# EAGLE design WhatFrankShould'veDone (EAGLE 6.3)
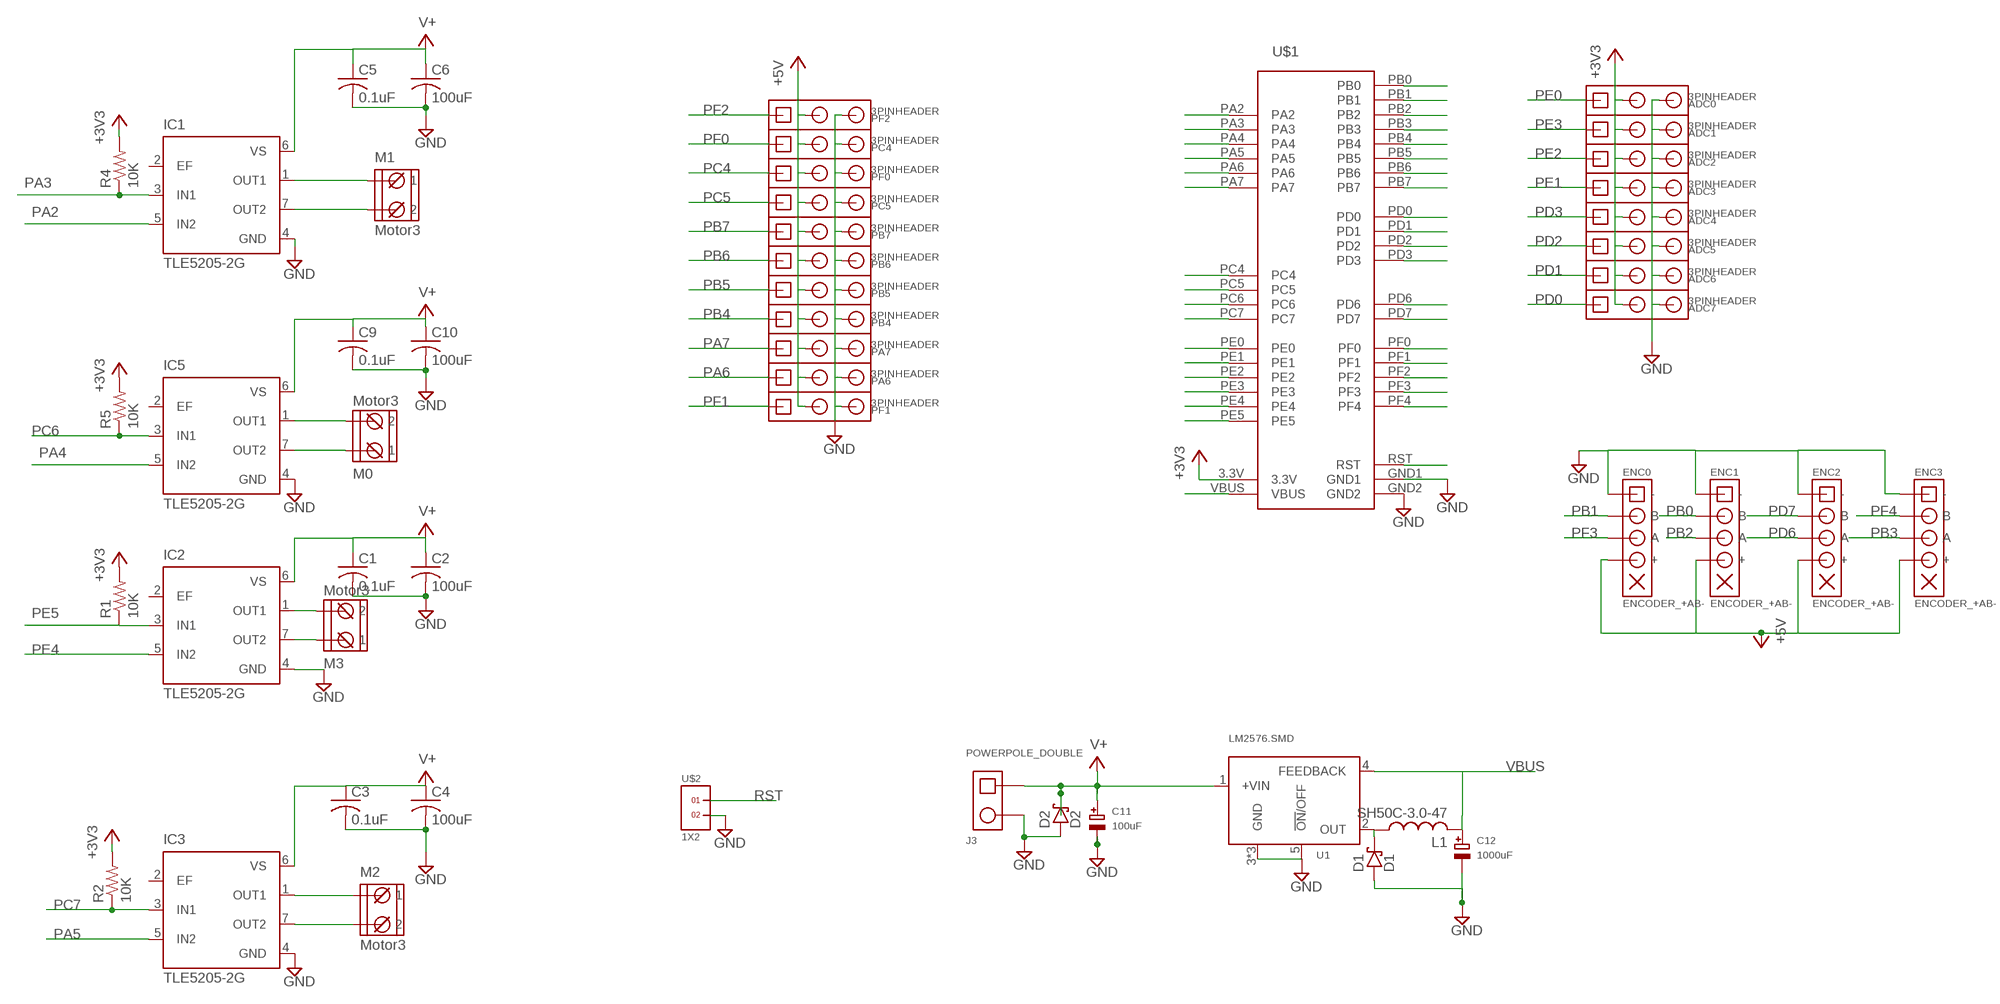
[diagram p0: schematic, sheet 1]

## Parts
ADC0  3PINHEADER  [3PINHEADER]
ADC1  3PINHEADER  [3PINHEADER]
ADC2  3PINHEADER  [3PINHEADER]
ADC3  3PINHEADER  [3PINHEADER]
ADC4  3PINHEADER  [3PINHEADER]
ADC5  3PINHEADER  [3PINHEADER]
ADC6  3PINHEADER  [3PINHEADER]
ADC7  3PINHEADER  [3PINHEADER]
C1  0.1uF  C-USC0603  [C0603]
C2  100uF  C-USC0603  [C0603]
C3  0.1uF  C-USC0603  [C0603]
C4  100uF  C-USC0603  [C0603]
C5  0.1uF  C-USC0603  [C0603]
C6  100uF  C-USC0603  [C0603]
C9  0.1uF  C-USC0603  [C0603]
C10  100uF  C-USC0603  [C0603]
C11  100uF  CAP_ELECTROLYTICPANASONIC_D  [PANASONIC_D]
C12  1000uF  CAP_ELECTROLYTICPANASONIC_D  [PANASONIC_D]
D1  D1  1N5820-D  [DIODE_17MM]
D2  D2  1N5820-D  [DIODE_17MM]
ENC0  ENCODER_+AB-  [0.1IN_HEADER_1X5]
ENC1  ENCODER_+AB-  [0.1IN_HEADER_1X5]
ENC2  ENCODER_+AB-  [0.1IN_HEADER_1X5]
ENC3  ENCODER_+AB-  [0.1IN_HEADER_1X5]
IC1  TLE5205-2G  [P-TO263-7-1]
IC2  TLE5205-2G  [P-TO263-7-1]
IC3  TLE5205-2G  [P-TO263-7-1]
IC5  TLE5205-2G  [P-TO263-7-1]
J3  POWERPOLE_DOUBLE  [POWERPOLE_DOUBLE]
L1  SH50C-3.0-47  [SH50-C2]
M0  Motor3  PHOENIXSCREWTERMINAL_2  [PHOENIXSCREWTERMINAL_2]
M1  Motor3  PHOENIXSCREWTERMINAL_2  [PHOENIXSCREWTERMINAL_2]
M2  Motor3  PHOENIXSCREWTERMINAL_2  [PHOENIXSCREWTERMINAL_2]
M3  Motor3  PHOENIXSCREWTERMINAL_2  [PHOENIXSCREWTERMINAL_2]
PA6  3PINHEADER  [3PINHEADER]
PA7  3PINHEADER  [3PINHEADER]
PB4  3PINHEADER  [3PINHEADER]
PB5  3PINHEADER  [3PINHEADER]
PB6  3PINHEADER  [3PINHEADER]
PB7  3PINHEADER  [3PINHEADER]
PC4  3PINHEADER  [3PINHEADER]
PC5  3PINHEADER  [3PINHEADER]
PF0  3PINHEADER  [3PINHEADER]
PF1  3PINHEADER  [3PINHEADER]
PF2  3PINHEADER  [3PINHEADER]
R1  10K  R-US_R0603  [R0603]
R2  10K  R-US_R0603  [R0603]
R4  10K  R-US_R0603  [R0603]
R5  10K  R-US_R0603  [R0603]
U1  LM2576.SMD  [KTT0005B]
U$1  STELLARIS-LAUNCHPADSTELLARIS-LAUNCHPAD-XL  [LAUNCHPAD-XL]
U$2  1X2  [1X2]

## Nets
+3V3: ADC0.2 ADC1.2 ADC2.2 ADC3.2 ADC4.2 ADC5.2 ADC6.2 ADC7.2 R1.2 R2.2 R4.2 R5.2 U$1.3.3V
+5V: ENC0.4(+) ENC1.4(+) ENC2.4(+) ENC3.4(+) PA6.2 PA7.2 PB4.2 PB5.2 PB6.2 PB7.2 PC4.2 PC5.2 PF0.2 PF1.2 PF2.2
-GND: ADC0.3 ADC1.3 ADC2.3 ADC3.3 ADC4.3 ADC5.3 ADC6.3 ADC7.3 C1.2 C2.2 C3.2 C4.2 C5.2 C6.2 C9.2 C10.2 C11.- C12.- D1.2(A) D2.2(A) ENC0.1(-) ENC1.1(-) ENC2.1(-) ENC3.1(-) IC1.4(GND) IC2.4(GND) IC3.4(GND) IC5.4(GND) J3.2 PA6.3 PA7.3 PB4.3 PB5.3 PB6.3 PB7.3 PC4.3 PC5.3 PF0.3 PF1.3 PF2.3 U1.3(GND) U1.5(!ON!/OFF) U1.GROUND(GND) U1.GROUND@1(GND) U$1.GND1 U$1.GND2 U$2.2 ; supply symbol labelled GND
N$2: IC2.1(OUT1) M3.2
N$4: IC2.7(OUT2) M3.1
N$6: IC3.1(OUT1) M2.1
N$7: IC1.1(OUT1) M1.1
N$8: IC1.7(OUT2) M1.2
N$9: IC3.7(OUT2) M2.2
N$11: D1.1(C) L1.P$1 U1.2(OUT)
N$12: IC5.1(OUT1) M0.2
N$13: IC5.7(OUT2) M0.1
PA2: IC1.5(IN2) U$1.PA2
PA3: IC1.3(IN1) R4.1 U$1.PA3
PA4: IC5.5(IN2) U$1.PA4
PA5: IC3.5(IN2) U$1.PA5
PA6: PA6.1 U$1.PA6
PA7: PA7.1 U$1.PA7
PB0: ENC1.2(B) U$1.PB0
PB1: ENC0.2(B) U$1.PB1
PB2: ENC1.3(A) U$1.PB2
PB3: ENC3.3(A) U$1.PB3
PB4: PB4.1 U$1.PB4
PB5: PB5.1 U$1.PB5
PB6: PB6.1 U$1.PB6
PB7: PB7.1 U$1.PB7
PC4: PF0.1 U$1.PC4
PC5: PC5.1 U$1.PC5
PC6: IC5.3(IN1) R5.1 U$1.PC6
PC7: IC3.3(IN1) R2.1 U$1.PC7
PD0: ADC7.1 U$1.PD0
PD1: ADC6.1 U$1.PD1
PD2: ADC5.1 U$1.PD2
PD3: ADC4.1 U$1.PD3
PD6: ENC2.3(A) U$1.PD6
PD7: ENC2.2(B) U$1.PD7
PE0: ADC0.1 U$1.PE0
PE1: ADC3.1 U$1.PE1
PE2: ADC2.1 U$1.PE2
PE3: ADC1.1 U$1.PE3
PE4: IC2.5(IN2) U$1.PE4
PE5: IC2.3(IN1) R1.1 U$1.PE5
PF0: PC4.1 U$1.PF0
PF1: PF1.1 U$1.PF1
PF2: PF2.1 U$1.PF2
PF3: ENC0.3(A) U$1.PF3
PF4: ENC3.2(B) U$1.PF4
RST: U$1.RST U$2.1
V+: C1.1 C2.1 C3.1 C4.1 C5.1 C6.1 C9.1 C10.1 C11.+ D2.1(C) IC1.6(VS) IC2.6(VS) IC3.6(VS) IC5.6(VS) J3.1 U1.1(+VIN)
VBUS: C12.+ L1.P$2 U1.4(FEEDBACK) U$1.VBUS
Unconnected: ENC0.5(X) ENC1.5(X) ENC2.5(X) ENC3.5(X) IC1.2(EF) IC2.2(EF) IC3.2(EF) IC5.2(EF)

## Library data of the parts
ADC0 ADC1-ADC7 PA6 PA7 PB4-PB7 PC4 PC5 PF0 PF1 PF2 = RASEagleLib:3PINHEADER: 3 Pin Header 0.1" Headers
C1-C6 C9 C10 = resistor:C-US: CAPACITOR, American symbol
C11 C12 = microbuilder:CAP_ELECTROLYTIC: Electrolytic Capacitors SMT PANASONIC_C - Size C Panasonic Electrolytic Aluminum Capacitor 47µF 16V 20% Electrolytic Capacitor [Digikey: PCE3890TR-ND] PANASONIC_D - Size D Panasonic Electrolytic Aluminum Capacitor 100µF 25V 20% Electrolytic Capacitor [Digikey: PCE3898TR-ND] PTH 3.5 mm grid, 8 mm diameter ... 3.5 mm grid, 10 mm diameter ...
D1 D2 = RASEagleLib:1N5820-D: 1N5820-D Schottky Diode
ENC0 ENC1-ENC3 = RASEagleLib:ENCODER_+AB-: Encoder Connector + A B - Configuration
IC1-IC3 IC5 = infineon:TLE5205-2: 5-A H-Bridge for DC-Motor Applications Source: http://www.infineon.com .. tle5205-2.pdf; OC_FARNELL: unknown; OC_NEWARK: unknown
J3 = RASEagleLib:POWERPOLE_DOUBLE: Double PowerPole Connector Good for battery connections.
L1 = RASEagleLib:SH50C-3.0-47: Inductor 47uH, 3 A SH50C-3.0-47
M0 M1-M3 = RASEagleLib:PHOENIXSCREWTERMINAL_2: Phoenix Screw Terminal 2 contacts, 5 mm pitch Terminal: 1934861 Pins: 1933189
R1 R2 R4 R5 = resistor:R-US_: RESISTOR, American symbol
U1 = RASEagleLib:LM2576: LM2576 Step Down Regulator
U$1 = StellarisLaunchPad_Fred:STELLARIS-LAUNCHPAD
U$2 = headers(.1in):1X2

## Board
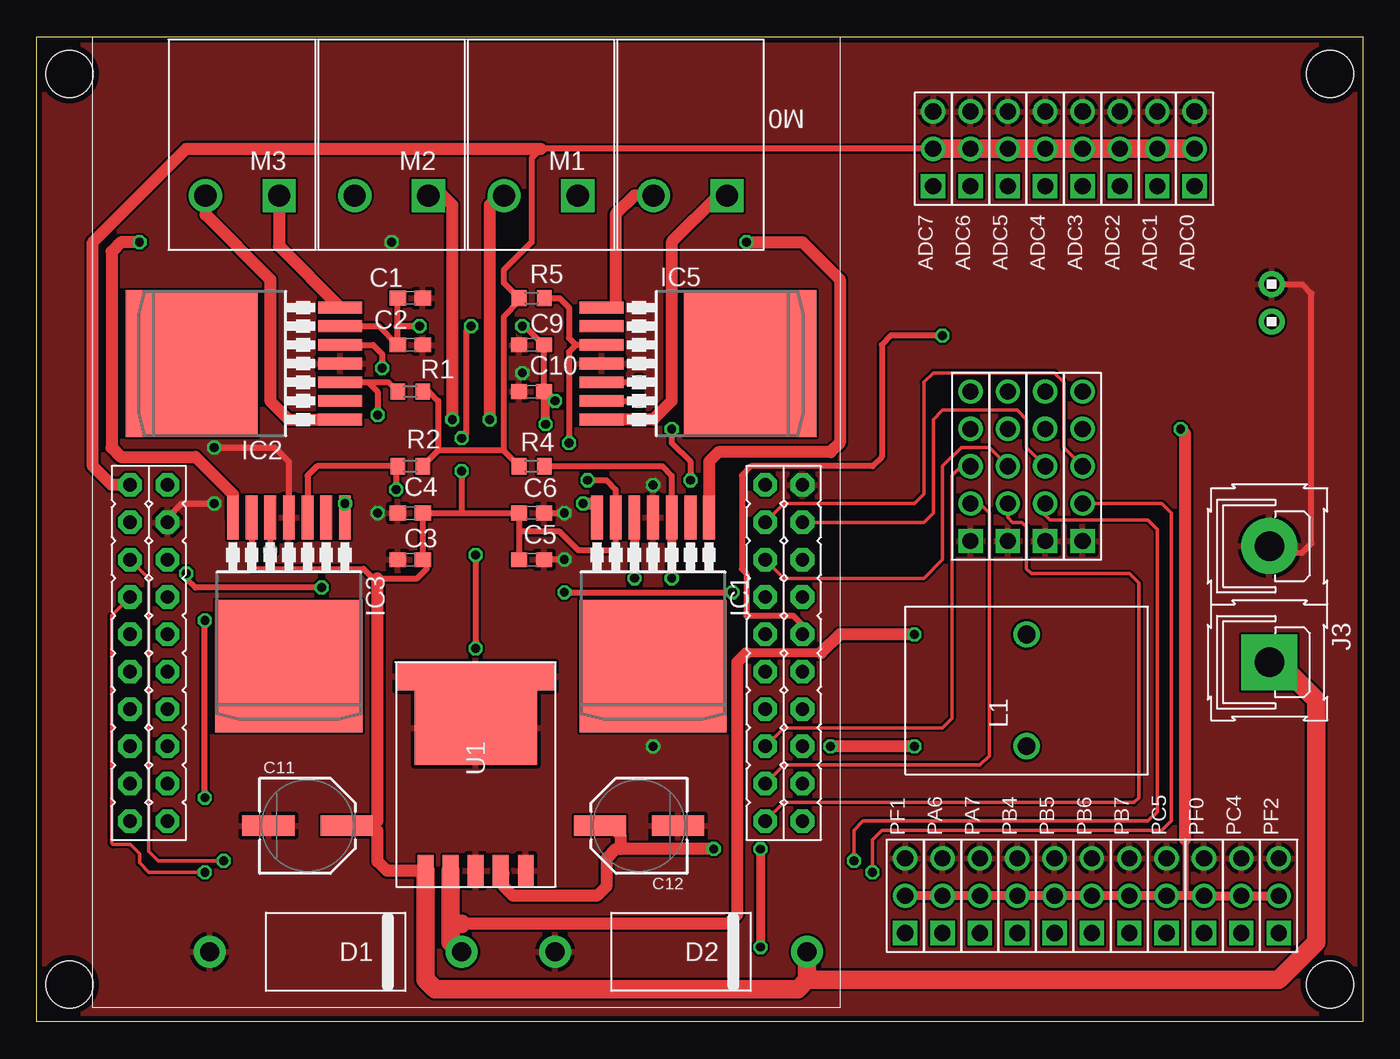
[diagram p1: board, top side]
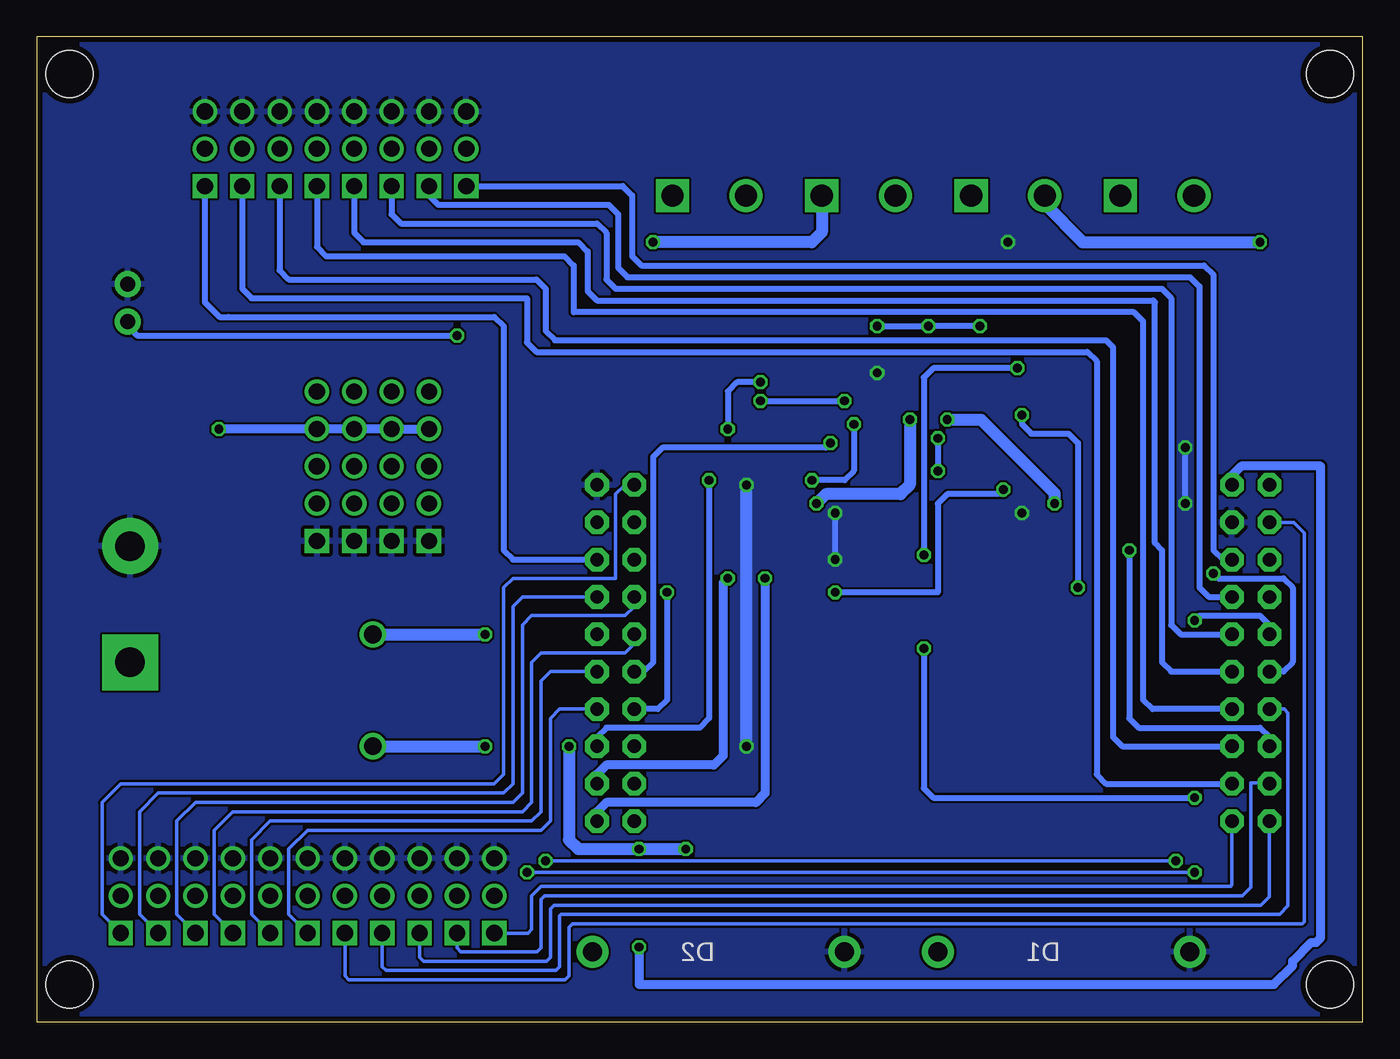
[diagram p2: board, bottom side, seen from below]

Size 90.17 x 66.99 mm. Coordinates in mm from the lower left corner, seen from the top.
Outline: 90.17,0 0,0 0,66.99 90.17,66.99 90.17,0
Copper layers (1*16): Top 0.0356mm / dielectric 1.5011mm / Bottom 0.0356mm
Design rules "OSHPark": minimum track width 6mil, minimum drill 13mil, track to track 6mil, track to pad 6mil, pad to pad 6mil, via to via 6mil, smd to smd 6mil, copper to edge 15mil, drill to drill 6mil, minimum pad ring 7mil, minimum via ring 7mil, stop-mask expansion 4mil, vias tented up to drill 16mil, thermal gap 10mil
Holes 3.2 mm at 87.95,64.45 87.95,2.54 2.22,2.54 2.22,64.45

### Footprints (pad centres in the part's own frame; a part is rotated, then mirrored left to right if it is on the bottom)
3PINHEADER = drill 1.1 square: 1 0,0 | drill 1.1: 2 2.54,0; 3 5.08,0
C0603 = smd 1.1 x 1: 1 -0.85,0; 2 0.85,0
PANASONIC_D = smd 3.556 x 1.4: + 2.654,0; - -2.654,0
DIODE_17MM = drill 1.3 pad 2.184: 1 -8.572,0; 2 8.572,0
0.1IN_HEADER_1X5 = drill 1.1 square: 1 -5.08,0 | drill 1.1: 2 -2.54,0; 3 0,0; 4 2.54,0; 5 5.08,0
P-TO263-7-1 = smd 0.8 x 3: 1 -3.81,-9.207; 2 -2.54,-9.207; 3 -1.27,-9.207; 4 0,-9.207; 5 1.27,-9.207; 6 2.54,-9.207; 7 3.81,-9.207 | smd 10 x 9: 8 0,0.895
POWERPOLE_DOUBLE = drill 2 pad 3.81 square: 1 0,0 | drill 2 pad 3.81: 2 7.9,0
SH50-C2 = drill 1.2: P$1 3.8,0; P$2 -3.8,0
PHOENIXSCREWTERMINAL_2 = drill 1.5 square: 1 -2.5,0 | drill 1.5: 2 2.5,0
R0603 = smd 1 x 1.1: 1 -0.85,0; 2 0.85,0
KTT0005B = smd 2.159 x 1.067: 1 14.173,-3.404; 2 14.173,-1.702; 3 14.173,0; 4 14.173,1.702; 5 14.173,3.404 | smd 5.08 x 8.331: GROUND 4.445,0 | smd 1.905 x 10.795: GROUND@1 0.953,0
LAUNCHPAD-XL = drill 0.914 pad 1.6 octagon: 3.3V 30.48,2.54; GND1 33.02,5.08; GND2 30.48,48.26; PA2 53.34,48.26; PA3 50.8,48.26; PA4 48.26,48.26; PA5 48.26,2.54; PA6 50.8,2.54; PA7 53.34,2.54; PB0 35.56,2.54; PB1 38.1,2.54; PB2 33.02,48.26; PB3 35.56,45.72; PB4 45.72,2.54; PB5 33.02,2.54; PB6 45.72,48.26; PB7 43.18,48.26; PC4 38.1,45.72; PC5 40.64,45.72; PC6 43.18,45.72; PC7 45.72,45.72; PD0 35.56,5.08; PD1 38.1,5.08; PD2 40.64,5.08; PD3 43.18,5.08; PD6 48.26,45.72; PD7 50.8,45.72; PE0 35.56,48.26; PE1 45.72,5.08; PE2 48.26,5.08; PE3 50.8,5.08; PE4 40.64,2.54; PE5 43.18,2.54; PF0 38.1,48.26; PF1 53.34,5.08; PF2 30.48,45.72; PF3 33.02,45.72; PF4 53.34,45.72; RST 40.64,48.26; VBUS 30.48,5.08
1X2 = drill 1.016 pad 1.778: 1 0,0; 2 2.54,0

### Placement (x,y rotation side)
ADC0  78.74,56.83 90 top
ADC1  76.2,56.83 90 top
ADC2  73.66,56.83 90 top
ADC3  71.12,56.83 90 top
ADC4  68.58,56.83 90 top
ADC5  66.04,56.83 90 top
ADC6  63.5,56.83 90 top
ADC7  60.96,56.83 90 top
C1  25.4,49.21 0 top
C2  25.4,46.04 0 top
C3  25.4,31.43 180 top
C4  25.4,34.61 180 top
C5  33.66,31.43 0 top
C6  33.66,34.61 0 top
C9  33.66,46.04 180 top
C10  33.66,42.86 180 top
C11  18.41,13.34 0 top
C12  40.96,13.34 180 top
D1  20.32,4.76 180 top
D2  43.82,4.76 180 top
ENC0  71.12,37.78 90 top
ENC1  68.58,37.78 90 top
ENC2  63.5,37.78 90 top
ENC3  66.04,37.78 90 top
IC1  41.91,25.08 180 top
IC2  11.43,44.77 90 top
IC3  17.14,25.08 180 top
IC5  47.62,44.77 270 top
J3  83.82,24.45 90 top
L1  67.31,22.54 90 top
M0  44.45,56.2 180 top
M1  34.29,56.2 180 top
M2  24.13,56.2 180 top
M3  13.97,56.2 180 top
PA6  61.59,6.03 90 top
PA7  64.14,6.03 90 top
PB4  66.67,6.03 90 top
PB5  69.22,6.03 90 top
PB6  71.75,6.03 90 top
PB7  74.3,6.03 90 top
PC4  81.92,6.03 90 top
PC5  76.84,6.03 90 top
PF0  79.38,6.03 90 top
PF1  59.05,6.03 90 top
PF2  84.45,6.03 90 top
R1  25.4,42.86 0 top
R2  25.4,37.78 0 top
R4  33.66,37.78 180 top
R5  33.66,49.21 180 top
U1  29.84,24.45 270 top
U$1  3.81,66.99 270 top
U$2  83.98,47.62 90 top

### Tracks (layer width: path | path; a pad name or v marks a point on that pad's centre or on a via)
+3V3
  Top 0.406: ADC7.2 34.29,59.37 33.66,58.74 33.66,53.02 31.75,51.12 31.75,50.27 R5.2 32.8,49 31.75,47.94 31.75,38.84 | 31.75,38.84 R4.2 | 31.75,38.84 27.3,38.84 | 27.3,38.84 R2.2 | R1.2 26.67,42.86 27.3,42.23 27.3,38.84
  Top 0.813: U$1.3.3V 5.08,36.51 3.81,37.78 3.81,53.02 10.16,59.37 34.29,59.37
  Top 1.27: ADC0.2 ADC1.2 ADC2.2 ADC3.2 ADC4.2 ADC5.2 ADC6.2 ADC7.2
+5V  (via drill 0.6)
  Top 0.406: PB4.2 PA7.2 PA6.2 PF1.2 | 78.11,12.38 78.11,8.57
  Top 0.61: PF2.2 PC4.2 PF0.2 78.11,8.57 PC5.2 PB7.2 PB6.2 PB5.2 PB4.2 PF1.2
  Top 0.813: 78.11,12.38 78.11,40.01 v77.79,40.32
  Bottom 0.406: ENC0.4 ENC1.4 ENC3.4
  Bottom 0.61: ENC2.4 ENC3.4 v77.79,40.32
-GND  (via drill 0.6)
  Top 0.406: U$2.2 86.04,50.16 86.68,49.53 86.68,32.54 86.04,31.91 84.26,31.91 J3.2 | 24.23,31.75 C3.2 | C6.2 v35.88,34.61 | v35.88,31.43 C5.2 | U$1.GND1 8.89,34.29 9.84,35.24 v12.07,35.24 | v12.07,39.05 16.19,39.05 17.14,38.1 IC3.4
  Bottom 0.406: v35.88,34.61 v35.88,31.43 | v12.07,35.24 v12.07,39.05
  Bottom 0.813: v41.91,18.73 v41.91,36.51
  other vias: 23.18,34.61 33.02,44.13 24.13,53.02
  pour Top: 0.16,0.32 90.17,0.32 90.17,66.67 0.32,66.67
  pour Bottom: 0.16,0.32 90.17,0.32 90.17,66.67 0.32,66.99
N$2
  Top 0.813: M3.2 11.47,54.89 15.88,50.48 15.88,42.23 17.14,40.96 IC2.1
N$4
  Top 0.813: M3.1 16.47,52.74 IC2.7
N$6  (via drill 0.6)
  Top 0.406: IC3.1 v20.95,35.24
  Top 0.813: v28.26,40.96 28.26,55.56 27.62,56.2 M2.1
  Bottom 0.813: v28.26,40.96 25.95,40.96 20.95,35.96 v20.95,35.24
N$7  (via drill 0.6)
  Top 0.813: v48.26,53.02 52.07,53.02 54.61,50.48 54.61,39.37 53.98,38.73 46.36,38.73 45.72,38.1 IC1.1
  Bottom 0.813: M1.1 36.79,53.7 37.47,53.02 v48.26,53.02
N$8  (via drill 0.6)
  Top 0.813: v30.8,40.96 30.8,55.55 31.43,56.18 31.45,56.2 M1.2 | v37.15,35.24 38.1,35.24 IC1.7
  Bottom 0.813: v30.8,40.96 30.8,36.51 31.43,35.88 36.51,35.88 v37.15,35.24
N$9  (via drill 0.6)
  Top 0.813: v6.98,53.02 5.71,53.02 5.08,52.39 5.08,39.05 5.71,38.42 10.79,38.42 13.34,35.88 IC3.7
  Bottom 0.813: M2.2 21.63,55.6 19.05,53.02 v6.98,53.02
N$11  (via drill 0.6)
  Top 0.61: 53.34,25.08 48.26,25.08
  Top 0.813: v59.69,26.35 54.61,26.35 53.34,25.08 | 48.26,25.08 47.62,24.45 47.62,7.3 46.99,6.67 28.89,6.67
  Top 1.27: D1.1 28.78,4.76 28.14,5.4 28.14,6.51 | 28.14,6.51 U1.2 | 28.89,6.67 28.3,6.67 28.14,6.51
  Bottom 0.813: L1.P$1 v59.7,26.34 v59.69,26.35
N$12
  Top 0.813: M0.2 40.64,56.2 39.37,54.93 39.37,48.58 IC5.1
N$13
  Top 0.813: M0.1 46.36,56.2 43.18,53.02 43.18,42.23 41.91,40.96 IC5.7
PA2  (via drill 0.6)
  Top 0.61: IC1.5 v40.64,30.16
  Bottom 0.61: v40.64,30.16 40.64,15.56 41.28,14.92 51.44,14.92 52.07,14.29 U$1.PA2
PA3  (via drill 0.6)
  Top 0.406: R4.1 42.55,37.78 43.18,37.15 IC1.3
  Top 0.61: IC1.3 v43.18,30.16
  Bottom 0.61: v43.18,30.16 43.5,29.84 43.5,18.1 44.13,17.46 51.44,17.46 52.07,16.83 U$1.PA3
PA4  (via drill 0.6)
  Top 0.406: IC5.5 v40.96,43.5 | v43.18,40.32 43.18,39.37 44.45,38.1 v44.45,36.83
  Bottom 0.406: v40.96,43.5 42.55,43.5 43.18,42.86 v43.18,40.32 | v44.45,36.83 44.45,20.64 45.09,20 51.44,20 52.07,19.37 U$1.PA4
PA5  (via drill 0.6)
  Top 0.406: IC3.5 v15.88,32.07
  Bottom 0.406: v15.88,32.07 15.88,20.64 15.24,20 6.98,20 6.35,19.37 U$1.PA5
PA6
  Bottom 0.254: PA6.1 61.59,5.02 61.34,4.76 56.13,4.76 55.88,5.02 55.88,8.32 55.63,8.57 8.19,8.57 7.62,9.14 7.62,16.26 6.41,16.26 U$1.PA6
PA7
  Bottom 0.254: PA7.1 64.14,4.38 63.88,4.13 55.5,4.13 55.25,4.38 55.25,7.68 54.99,7.94 6.92,7.94 6.35,8.51 U$1.PA7
PB0  (via drill 0.6)
  Top 0.254: v55.56,10.95 55.56,13.02 56.2,13.65 75.56,13.65 76.2,14.29 76.2,33.5 75.56,34.13 68.9,34.13 68.58,34.45 ENC1.2 | v12.7,10.95 8.26,10.95 7.62,11.59 7.62,30.16 U$1.PB0
  Top 0.406: ENC1.2 67.95,35.24
  Bottom 0.254: v55.56,10.95 v12.7,10.95
PB1  (via drill 0.6)
  Top 0.254: ENC0.2 76.52,35.24 77.15,34.61 77.15,13.65 76.52,13.02 57.47,13.02 56.83,12.38 v56.83,10.16 | U$1.PB1 5.08,27.62 5.08,12.16 5.17,12.07 6.35,12.07 6.98,11.43 6.98,10.79 7.62,10.16 v11.43,10.16
  Bottom 0.254: v56.83,10.16 v11.43,10.16
PB2
  Top 0.254: ENC1.3 67.31,39.05 67.31,40.96 66.67,41.59 61.59,41.59 60.96,40.96 60.96,34.61 60.33,33.97 U$1.PB2
PB3
  Top 0.254: ENC3.3 64.77,39.05 62.87,39.05 61.59,37.78 61.59,31.43 60.33,30.16 50.8,30.16 U$1.PB3
PB4
  Bottom 0.254: PB4.1 66.67,3.75 66.42,3.49 54.86,3.49 54.61,3.75 54.61,7.21 54.52,7.3 5.65,7.3 5.08,7.87 5.08,21.02 5.33,21.27 U$1.PB4
PB5
  Bottom 0.254: PB5.1 69.22,3.11 68.96,2.86 54.23,2.86 53.98,3.11 53.98,6.41 53.72,6.67 38.1,6.67 | U$1.PB5 4.7,33.97 3.97,33.24 3.97,6.81 4.11,6.67 38.1,6.67 | 38.1,6.67
PB6
  Bottom 0.254: PB6.1 73.03,7.3 73.03,11.75 71.75,13.02 55.88,13.02 55.25,13.65 55.25,20.64 54.61,21.27 U$1.PB6
PB7
  Bottom 0.254: PB7.1 75.56,7.3 75.56,12.38 74.3,13.65 56.52,13.65 55.88,14.29 55.88,23.18 55.25,23.81 U$1.PB7
PC4
  Bottom 0.254: PF0.1 80.64,7.3 80.64,13.65 79.38,14.92 57.79,14.92 57.15,15.56 57.15,26.99 56.52,27.62 50.16,27.62 49.53,28.26 U$1.PC4
PC5
  Bottom 0.254: PC5.1 78.11,7.3 78.11,13.02 76.84,14.29 57.15,14.29 56.52,14.92 56.52,24.45 55.88,25.08 50.16,25.08 49.53,25.72 U$1.PC5
PC6  (via drill 0.6)
  Top 0.406: v36.2,39.37 36.2,45.56 36.67,46.04 | IC5.3 36.67,46.04 | 36.67,46.04 36.2,46.51 36.2,48.58 35.56,49.21 R5.1
  Bottom 0.406: U$1.PC6 48.9,23.81 48.26,24.45 48.26,38.42 47.62,39.05 36.51,39.05 v36.2,39.37
PC7  (via drill 0.6)
  Top 0.406: IC3.3 18.41,37.15 19.05,37.78 R2.1 24.45,37.68 v24.45,36.19 | v35.88,29.21 v47.31,29.21
  Bottom 0.406: v24.45,36.19 24.45,35.88 28.26,35.88 28.89,35.24 28.89,29.21 v35.88,29.21 | v47.31,29.21 47.31,21.91 47.94,21.27 U$1.PC7
PD0
  Bottom 0.406: ADC7.1 50.32,56.83 49.69,56.2 49.69,52.07 49.05,51.44 10.79,51.44 10.16,50.8 10.16,32.07 9.53,31.43 U$1.PD0
PD1
  Bottom 0.406: ADC6.1 63.5,56.2 62.87,55.56 51.28,55.56 50.64,54.93 50.64,51.28 50.01,50.64 11.75,50.64 11.11,50.01 11.11,29.53 10.48,28.89 U$1.PD1
PD2
  Bottom 0.406: ADC5.1 66.04,54.93 65.41,54.29 52.07,54.29 51.44,53.66 51.44,50.48 50.8,49.85 13.65,49.85 13.02,49.21 13.02,26.99 12.38,26.35 U$1.PD2
PD3
  Bottom 0.406: ADC4.1 68.58,53.66 67.95,53.02 53.34,53.02 52.71,52.39 52.71,49.69 52.07,49.05 14.26,49.05 14.14,48.93 14.14,32.55 13.65,32.07 13.65,24.45 13.02,23.81 U$1.PD3
PD6
  Top 0.254: ENC2.3 62.87,37.78 62.23,37.15 62.23,20.64 61.59,20 50.8,20 U$1.PD6
PD7
  Top 0.254: ENC2.2 64.14,35.24 64.77,34.61 64.77,18.1 64.14,17.46 50.8,17.46 U$1.PD7
PE0
  Bottom 0.406: U$1.PE0 57.79,31.43 58.42,32.07 58.42,47.31 59.05,47.94 77.15,47.94 77.74,47.94 78.74,48.94 ADC0.1
PE1
  Bottom 0.406: ADC3.1 71.12,52.7 70.48,52.07 54.29,52.07 53.66,51.44 53.66,48.26 15.56,48.26 14.92,47.62 14.92,21.91 14.29,21.27 U$1.PE1
PE2
  Bottom 0.406: ADC2.1 73.66,51.12 73.03,50.48 56.2,50.48 55.56,49.85 55.56,46.99 54.93,46.36 17.47,46.36 16.98,45.87 16.98,19.37 16.35,18.74 16.35,18.73 U$1.PE2
PE3
  Bottom 0.406: ADC1.1 76.2,49.85 75.56,49.21 56.83,49.21 56.83,46.2 56.2,45.56 18.73,45.56 18.1,44.93 18.1,16.83 17.46,16.19 U$1.PE3
PE4  (via drill 0.6)
  Top 0.406: IC2.5 22.86,46.04 23.49,45.4 v23.49,44.45 | v29.84,31.75 v29.84,25.4 | v11.43,15.24 v11.43,27.3
  Bottom 0.406: v23.49,44.45 29.21,44.45 29.84,43.81 v29.84,31.75 | v29.84,25.4 29.84,15.87 29.21,15.24 v11.43,15.24 | v11.43,27.3 11.11,27.62 6.98,27.62 6.35,26.99 U$1.PE4
PE5  (via drill 0.6)
  Top 0.406: R1.1 23.91,43.5 IC2.3 22.54,43.5 23.18,42.86 v23.18,41.27 | v19.37,29.53 10.79,29.53 10.16,30.16 v10.16,30.48
  Bottom 0.406: v23.18,41.27 23.18,40.64 22.54,40.01 20,40.01 19.37,39.37 v19.37,29.53 | v10.16,30.48 9.84,30.16 5.4,30.16 4.76,29.53 4.76,24.45 5.4,23.81 U$1.PE5
PF0
  Bottom 0.254: PC4.1 83.19,7.3 83.19,14.29 81.92,15.56 58.42,15.56 57.79,16.19 57.79,28.26 57.15,28.89 U$1.PF0
PF1
  Bottom 0.254: PF1.1 56.77,6.03 56.52,6.29 56.52,8.57 55.88,9.21 8.98,9.21 8.89,9.3 U$1.PF1
PF2
  Bottom 0.254: PF2.1 85.73,7.3 85.73,14.92 84.45,16.19 59.05,16.19 58.42,16.83 58.42,29.53 57.79,30.16 50.8,30.16 50.8,35.88 50.16,36.51 U$1.PF2
PF3
  Top 0.254: ENC0.3 69.85,39.05 69.85,43.5 69.22,44.13 60.96,44.13 60.33,43.5 60.33,35.88 59.69,35.24 50.8,35.24 U$1.PF3
PF4
  Top 0.254: 49.53,13.02 U$1.PF4 50.8,14.92 74.61,14.92 74.93,15.24 74.93,29.84 74.3,30.48 67.63,30.48 67.31,30.8 67.31,33.66 66.99,33.97 66.36,33.97 66.04,34.29 ENC3.2
RST  (via drill 0.6)
  Top 0.406: v61.59,46.67 58.1,46.67 57.47,46.04 57.47,38.42 56.83,37.78 48.58,37.78 47.94,37.15 47.94,30.8 48.26,30.48 48.26,27.62 51.44,27.62 52.07,26.99 U$1.RST
  Bottom 0.406: U$2.1 83.98,47.31 83.34,46.67 v61.59,46.67
V+  (via drill 0.6)
  Top 0.152: 26.67,31.43 26.51,31.43 C3.1
  Top 0.406: C9.1 C10.1 34.61,42.86 v35.24,42.23 | IC2.6 23.28,47.31 C2.1 | C2.1 24.55,47.31 | 24.55,47.31 C1.1 | 32.8,33.34 C6.1 28.89,34.61 | 32.8,33.34 C5.1 | 28.89,34.61 C4.1 C3.1 | v37.47,36.83 38.73,36.83 39.37,36.19 IC1.6 39.37,32.07 36.83,32.07 35.56,33.34 32.8,33.34 | IC3.6 14.61,30.8 22.22,30.8 22.86,30.16 23.18,30.16 25.88,30.16 26.51,30.8 26.51,31.43 | 24.55,47.31 v26.04,47.31 24.45,47.31 24.55,47.2 C2.1 | IC5.6 v40.96,42.23 | v29.53,47.31 29.21,46.99 29.21,40.01 v28.89,39.69 | v28.89,37.47 28.89,34.61 | v33.02,47.31 33.18,47.31 34.45,46.04 34.45,46.2
  Top 0.61: v34.61,40.64 34.61,42.86
  Top 0.813: 26.67,10.27 U1.1 23.81,10.27 23.18,10.91 23.18,13.02 21.59,13.02 21.59,13.34 22.86,13.34 23.18,13.65 23.18,30.16
  Top 1.27: J3.1 84.45,24.45 87,21.91 87,5.4 84.45,2.86 52.39,2.86 | D2.1 52.39,2.86 | 52.39,2.86 51.75,2.22 27.08,2.22 26.44,2.86 U1.1 | 21.59,13.34 C11.+
  Bottom 0.406: v34.61,40.64 34.61,37.47 35.24,36.83 v37.47,36.83 | v33.02,47.31 v29.53,47.31 v26.04,47.31 | v40.96,42.23 v35.24,42.23 | v28.89,39.69 v28.89,37.47
VBUS  (via drill 0.6)
  Top 0.61: v49.21,11.75 v49.21,5.08
  Top 0.813: v59.69,18.73 v53.98,18.73 | v46.04,11.75 39.69,11.75 | 39.69,11.75 39.37,11.75 38.73,11.11 38.73,9.21 38.1,8.57 32.38,8.57 31.75,9.21 31.75,10.07 U1.4 | C12.+ 39.05,13.34 39.69,12.7 39.69,11.75
  Bottom 0.61: v49.21,5.08 49.21,2.54 6.03,2.54 4.76,3.81 4.76,4.13 3.49,5.4 3.17,5.4 2.86,5.72 2.86,37.78 8.26,37.78 8.89,37.15 U$1.VBUS | 8.89,36.19 U$1.VBUS | U$1.VBUS 8.57,36.19
  Bottom 0.813: L1.P$2 v59.7,18.74 v59.69,18.73 | v53.98,18.73 53.98,12.38 53.34,11.75 v49.21,11.75 v46.04,11.75

### Text on the board
tPlate: -+3.3V | -GND | -Sig | -GND | Reset- | -+5V | -A | -B | -GND | V- | V+ | -Sig | -GND | -+5V